# Altium schematic sheet UART.SchDoc
size A4; SheetNumber: 3; SheetTotal: 7
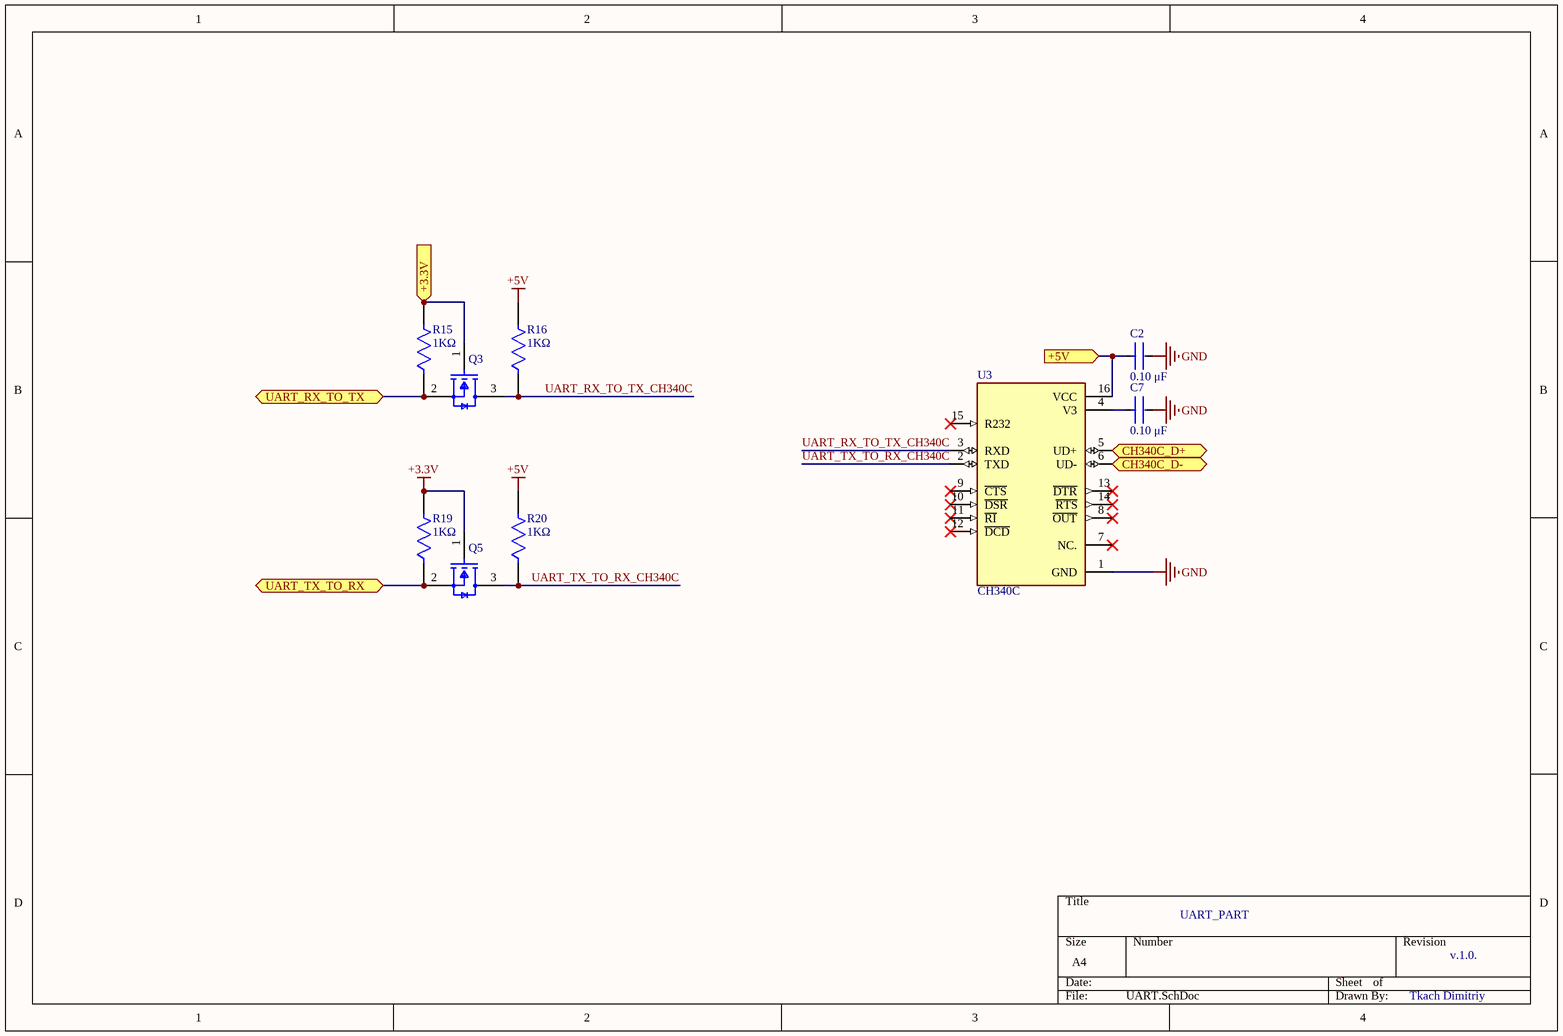
[diagram p0: UART.SchDoc]

## Parts
C2  Capacitance: 0.10 μF  [CAPC3216X18M]  (hidden comment: C1206C104K5RACAUTO)
C7  Capacitance: 0.10 μF  [CAPC3216X18M]  (hidden comment: C1206C104K5RACAUTO)
Q3  2N7002-7-F  [FP-SOT23-MFG]  (value not drawn)
Q5  2N7002-7-F  [FP-SOT23-MFG]  (value not drawn)
R15  value 1KΩ  [RESC3216X06M]  (hidden comment: CRGCQ1206F1K0)
R16  value 1KΩ  [RESC3216X06M]  (hidden comment: CRGCQ1206F1K0)
R19  value 1KΩ  [RESC3216X06M]  (hidden comment: CRGCQ1206F1K0)
R20  value 1KΩ  [RESC3216X06M]  (hidden comment: CRGCQ1206F1K0)
U3  CH340C  [SOIC127P600X180-16N]

## Ports
+3.3V (in, see MainSheet[2B], NTC[3B], Power[3B], STM8S103F3P6[3B], TM1637_Display[1B]), +5V (in, see MainSheet[2B], Power[3B], Relay[2B], TM1637_Display[3B]), CH340C_D+ (bidir, see MainSheet[1B], Power[2C]), CH340C_D- (bidir, see MainSheet[1B], Power[2C]), UART_RX_TO_TX (bidir, see MainSheet[2B], STM8S103F3P6[2C]), UART_TX_TO_RX (bidir, see MainSheet[2B], STM8S103F3P6[2C])

## Nets
+3.3V: Q5.1(G) R19.2
+5V: R16.2 R20.2
GND: C2.2 C7.2 U3.1(GND)
+3.3V: Q3.1(G) R15.2 ; port +3.3V  [a separate net that carries the same name]
+5V: C2.1 U3.16(VCC) ; port +5V  [a separate net that carries the same name]
CH340C_D+: U3.5(UD+) ; port CH340C_D+
CH340C_D-: U3.6(UD-) ; port CH340C_D-
UART_RX_TO_TX: Q3.2(S) R15.1 ; port UART_RX_TO_TX
UART_RX_TO_TX_CH340C: Q3.3(D) R16.1 U3.3(RXD)
UART_TX_TO_RX: Q5.2(S) R19.1 ; port UART_TX_TO_RX
UART_TX_TO_RX_CH340C: Q5.3(D) R20.1 U3.2(TXD)
NetC7_1: C7.1 U3.4(V3)

Not connected (* = marked no-connect by the designer): U3 7(NC.)* 8(~{OUT})* 9(~{CTS})* 10(~{DSR})* 11(~{RI})* 12(~{DCD})* 13(~{DTR})* 14(~{RTS})* 15(R232)*

## Notes on the sheet
- UART_PART
- v.1.0.
- Tkach Dimitriy

## Library data of the parts
C2 C7 = CMP-03020-005759-1: CAP CER 0.1UF 50V X7R 1206; Manufacturer: KEMET; Temperature Coefficient: 15%; Value: 0.10 μF; Material: Ceramic; Automotive Grade: Grade 0; Tolerance: 0.1; RoHS: TRUE; Lead Free: Yes; ComponentLink2Description: Datasheet; Automotive: Yes; Temperature Characteristic: X7R; Temperature Range Low: -55°C; Voltage Rating: 50 V; Device Class L1: Passive Components; Ipc Land Pattern Name: CAPC320160X78; Mouser Description: Multilayer Ceramic Capacitors MLCC - SMD/SMT 0.1uF 50volts 10% X7R AUTO; Octopart: https://octopart.com/c1206c104k5racauto-kemet-12595586; Device Class L3: Ceramic Capacitors; Manufacturer Part Number: C1206C104K5RACAUTO; Digikey Description: CAP CER 0.1UF 50V X7R 1206; Temperature Range High: +150°C; Temperature: -55°C to +150°C; Device Class L2: Capacitors; ComponentLink2URL: https://content.kemet.com/datasheets/KEM_C1007_X8R_ULTRA_150C_SMD.pdf; Package: C1206C-EB; Category: Cap; Height: 0.88mm
Q3 Q5 = 3b9c635fedb024a5347a57b145af9cc: MOSFET N-CH 60V 115MA SOT23-3; Turn-On Delay Time: 7ns; Turn-Off Delay Time: 11ns; Drain to Source Resistance: 7.5R; Rise Time: 3ns; Drain to Source Breakdown Voltage: 70V; Input Capacitance: 50pF; Number of Elements: 1; Power Dissipation: 540mW; Max Power Dissipation: 300mW; Fall Time: 5.6ns; Gate to Source Voltage (Vgs): 20V; Threshold Voltage: 2.5V; Element Configuration: Single; Termination: SMD/SMT; Weight: 0.000282oz; Radiation Hardening: No; Max Operating Temperature: 150°C; On-State Resistance: 7.5R; Mount: Surface Mount; Current Rating: 115mA; Contact Plating: Tin; Lead Free: Lead Free; Min Operating Temperature: -55°C; Number of Pins: 3; REACH SVHC: No SVHC; Drain to Source Voltage (Vdss): 60V; Width: 1.3mm; Package Quantity: 3000; Length: 2.9mm; Case/Package: SOT-23; Number of Channels: 1; Dual Supply Voltage: 60V; Packaging: Tape and Reel; Height: 1mm; Voltage Rating (DC): 60V; Nominal Vgs: 2.5V; Continuous Drain Current (ID): 115mA; Voltage: 60V; Rds On Max: 7.5R
R15 R16 R19 R20 = CMP-03211-006592-1: CRGCQ1206 1KΩ 0.25W 1% ±100ppm/°C 200V; Manufacturer: TE Connectivity; Automotive Grade: Grade 685; Tolerance: 0.01; Ipc Land Pattern Name: RESC310155X55; Temperature Range Low: -55°C; Device Class L3: Chip SMD Resistors; ComponentLink2URL: https://www.te.com/commerce/DocumentDelivery/DDEController?Action=showdoc&DocId=Data+Sheet%7F1773204-3%7F1%7Fpdf%7FEnglish%7FENG_DS_1773204-3_1.pdf%7F4-2176347-694; Automotive: Yes; Temperature: -55°C to +155°C; Manufacturer Part Number: CRGCQ1206F1K0; Package: CRGCQ1206; Octopart: https://octopart.com/crgcq1206f1k0-te+connectivity-91018258; Device Class L1: Passive Components; Series: CRGCQ; Device Class L2: Resistors; RoHS: TRUE; Lead Free: Yes; ComponentLink2Description: Datasheet; Power Rating: 0.25W; Temperature Coefficient: ±100ppm/°C; Voltage Rating: 200V; Temperature Range High: +155°C; Height: 0.65mm; Category: Res; Resistance: 1KΩ; Composition: Thick Film; Ambient Temperature Range High: +70°C
U3 = CMP-019-000000-1: USB to serial chip CH340; MF: WCH; Component Type: Standard; Design Item ID: CH340C; Availability: Not in stock; MP: CH340C; Value: *; Source: CH340C.SchLib; SnapEDA_Link: https://www.snapeda.com/parts/CH340C/WCH/view-part/?ref=snap; Package: None; Pin Count: 16; Check_prices: https://www.snapeda.com/parts/CH340C/WCH/view-part/?ref=eda; Price: None